# EAGLE design RaspPiPSOC (EAGLE 6.5.0)
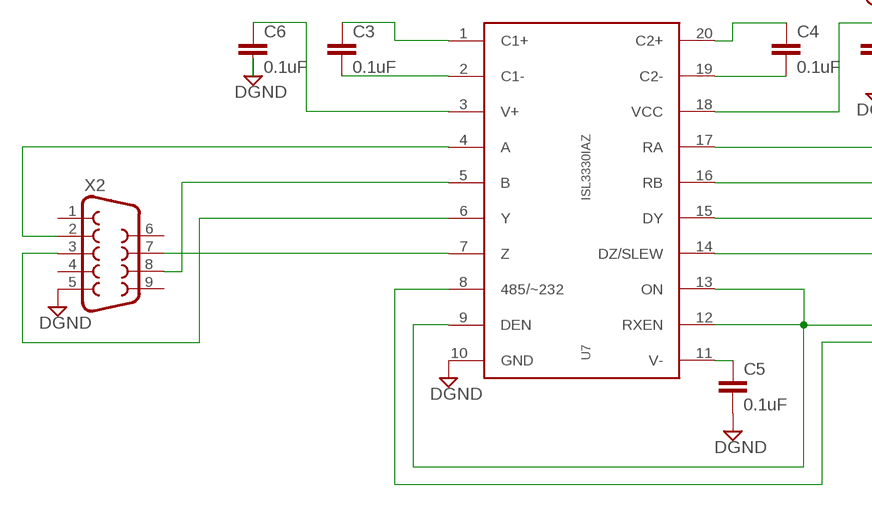
[diagram p0: schematic, sheet 1, part 1 of 2]
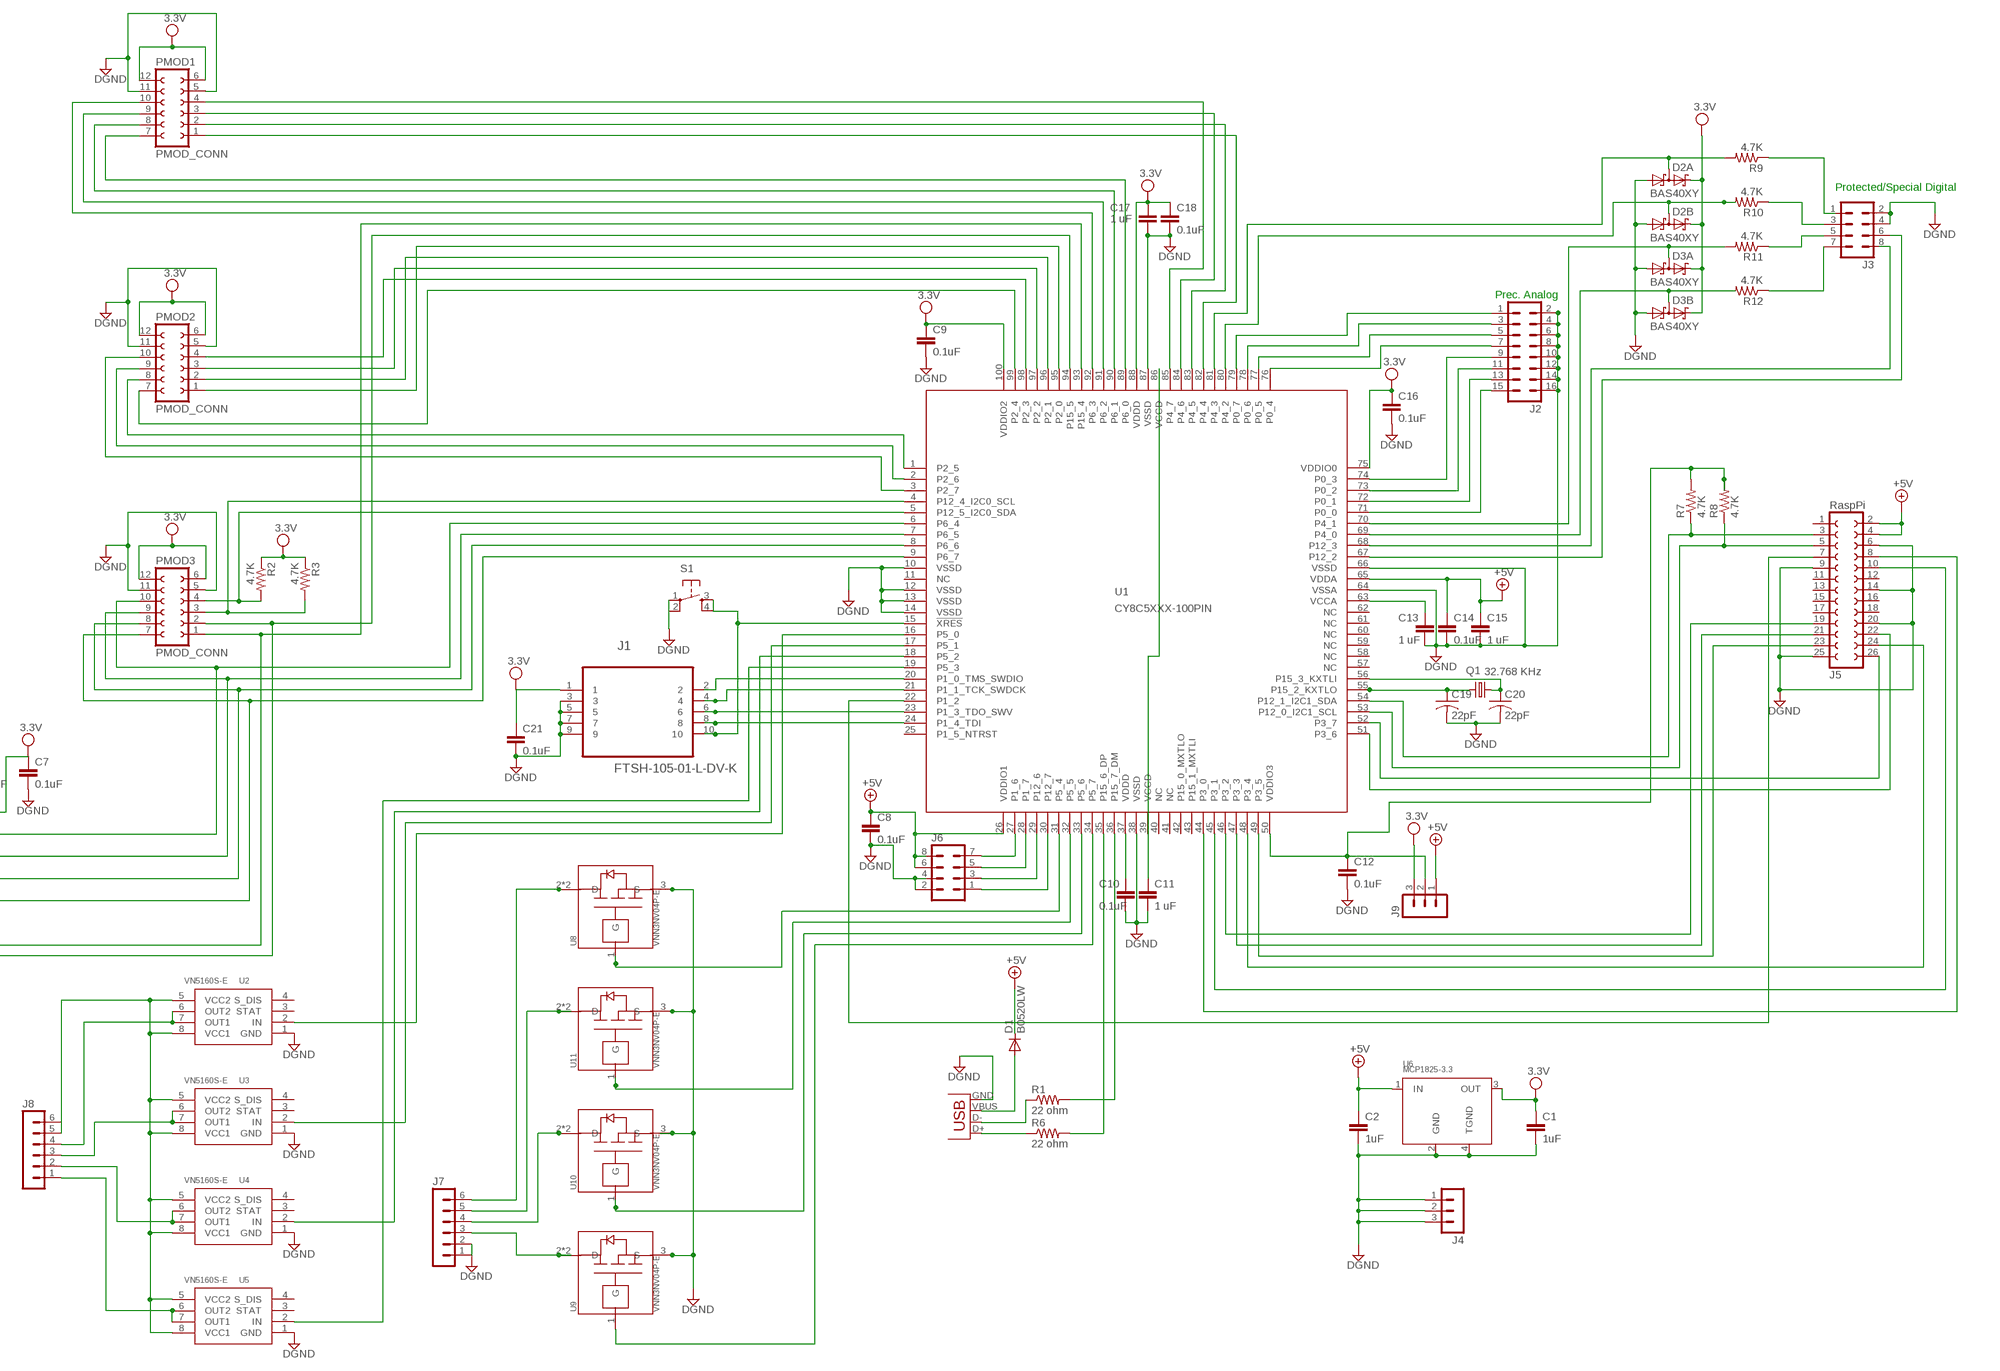
[diagram p1: schematic, sheet 1, part 2 of 2]

## Parts
C1  1uF  C-EUC0805  [C0805]
C2  1uF  C-EUC0805  [C0805]
C3  0.1uF  C-EUC0805  [C0805]
C4  0.1uF  C-EUC0805  [C0805]
C5  0.1uF  C-EUC0805  [C0805]
C6  0.1uF  C-EUC0805  [C0805]
C7  0.1uF  C-EUC0805  [C0805]
C8  0.1uF  C-EUC0805  [C0805]
C9  0.1uF  C-EUC0805  [C0805]
C10  0.1uF  C-EUC0805  [C0805]
C11  1 uF  C-EUC0805  [C0805]
C12  0.1uF  C-EUC0805  [C0805]
C13  1 uF  C-EUC0805  [C0805]
C14  0.1uF  C-EUC0805  [C0805]
C15  1 uF  C-EUC0805  [C0805]
C16  0.1uF  C-EUC0805  [C0805]
C17  1 uF  C-EUC0805  [C0805]
C18  0.1uF  C-EUC0805  [C0805]
C19  22pF  C-USC0805  [C0805]
C20  22pF  C-USC0805  [C0805]
C21  0.1uF  C-EUC0805  [C0805]
D1  B0520LW  CGRM4003-G  [SOD-123_MINI-SMA]
D2  BAS40XY  BAS70XY  [SOT363_PHILIPS]
D3  BAS40XY  BAS70XY  [SOT363_PHILIPS]
J1  FTSH-105-01-L-DV-K  [SAMTEC_FTSH-105-01-L-DV-K]
J2  MA08-2  [MA08-2]
J3  MA04-2  [MA04-2]
J4  MA03-1  [MA03-1]
J5  RaspPi  FE13-2  [FE13-2]
J6  MA04-2  [MA04-2]
J7  MA06-1  [MA06-1]
J8  MA06-1  [MA06-1]
J9  MA03-1  [MA03-1]
PMOD1  PMOD_CONN  [PMOD_CONN]
PMOD2  PMOD_CONN  [PMOD_CONN]
PMOD3  PMOD_CONN  [PMOD_CONN]
Q1  32.768 KHz  CRYSTALTC26H  [TC26H]
R1  22 ohm  R-US_R0805  [R0805]
R2  4.7K  R-US_R0805  [R0805]
R3  4.7K  R-US_R0805  [R0805]
R6  22 ohm  R-US_R0805  [R0805]
R7  4.7K  R-US_R0805  [R0805]
R8  4.7K  R-US_R0805  [R0805]
R9  4.7K  R-US_R0805  [R0805]
R10  4.7K  R-US_R0805  [R0805]
R11  4.7K  R-US_R0805  [R0805]
R12  4.7K  R-US_R0805  [R0805]
S1  TAC_SWITCHSMD  [TACTILE_SWITCH_SMD]
U1  CY8C5XXX-100PIN  [TQFP-14X14-100]
U2  VN5160S-E  [SOIC8]
U3  VN5160S-E  [SOIC8]
U4  VN5160S-E  [SOIC8]
U5  VN5160S-E  [SOIC8]
U6  MCP1825-3.3  TC1262  [SOT223]
U7  ISL3330IAZ  [SSOP20]
U8  VNN3NV04P-E  [SOT223]
U9  VNN3NV04P-E  [SOT223]
U10  VNN3NV04P-E  [SOT223]
U11  VNN3NV04P-E  [SOT223]
X1  USBSMD  [USB-MINIB]
X2  DB9  [DB9]

## Nets
+5V: C2.1 C8.1 C14.1 C15.1 D1.C J5.2 J5.4 J6.6 J6.8 J9.1 U1.26(VDDIO1) U1.65(VDDA) U6.1(IN)
DGND: C1.2 C2.2 C5.2 C6.2 C7.2 C8.2 C9.2 C10.2 C11.2 C12.2 C13.2 C14.2 C15.2 C16.2 C17.2 C18.2 C19.2 C20.2 C21.2 D2.1(A:A1) D2.4(B:A1) D3.1(A:A1) D3.4(B:A1) J1.3 J1.5 J1.7 J1.9 J2.2 J2.4 J2.6 J2.8 J2.10 J2.12 J2.14 J2.16 J3.2 J3.4 J4.1 J4.2 J4.3 J5.6 J5.9 J5.14 J5.20 J5.25 J6.2 J6.4 J7.1 J7.2 PMOD1.5 PMOD1.11 PMOD2.5 PMOD2.11 PMOD3.5 PMOD3.11 S1.1 S1.2 U1.10(VSSD) U1.12(VSSD) U1.13(VSSD) U1.14(VSSD) U1.38(VSSD) U1.64(VSSA) U1.66(VSSD) U1.87(VSSD) U2.1(GND) U3.1(GND) U4.1(GND) U5.1(GND) U6.2(GND) U6.4(TGND) U7.10(GND) U8.3(S) U9.3(S) U10.3(S) U11.3(S) X1.GND X2.5
N$1: C12.1 J9.2 R7.2 R8.2 U1.50(VDDIO3)
N$2: PMOD3.10 U1.6(P6_4) U7.17(RA)
N$3: J8.3 U3.6(OUT2) U3.7(OUT1)
N$4: J8.2 U4.6(OUT2) U4.7(OUT1)
N$5: J8.1 U5.6(OUT2) U5.7(OUT1)
N$6: PMOD3.4 R2.2 U1.5(P12_5_I2C0_SDA)
N$7: PMOD3.3 R3.2 U1.4(P12_4_I2C0_SCL)
N$8: C20.1 Q1.1 U1.56(P15_3_KXTLI)
N$9: C19.1 Q1.2 U1.55(P15_2_KXTLO)
N$10: J5.7 U1.22(P1_2)
N$11: PMOD3.2 U1.94(P15_5) U7.8(485/~232)
N$12: PMOD3.8 U1.8(P6_6) U7.15(DY)
N$13: PMOD2.1 U1.95(P2_0)
N$14: PMOD2.2 U1.96(P2_1)
N$15: PMOD2.3 U1.97(P2_2)
N$16: PMOD2.4 U1.98(P2_3)
N$17: PMOD2.7 U1.99(P2_4)
N$18: PMOD2.8 U1.1(P2_5)
N$19: C11.1 U1.39(VCCD) U1.86(VCCD)
N$20: PMOD2.9 U1.2(P2_6)
N$21: PMOD2.10 U1.3(P2_7)
N$22: PMOD1.3 U1.84(P4_6)
N$23: PMOD1.10 U1.92(P6_3)
N$24: C10.1 U1.37(VDDD)
N$25: C13.1 U1.63(VCCA)
N$26: PMOD1.9 U1.91(P6_2)
N$27: PMOD1.8 U1.90(P6_1)
N$28: PMOD1.7 U1.89(P6_0)
N$29: J5.19 U1.46(P3_2)
N$30: PMOD1.1 U1.82(P4_4)
N$31: PMOD1.2 U1.83(P4_5)
N$32: PMOD1.4 U1.85(P4_7)
N$33: J5.22 U1.51(P3_6)
N$34: J5.26 U1.52(P3_7)
N$35: C4.1 U7.20(C2+)
N$36: C4.2 U7.19(C2-)
N$37: C3.2 U7.2(C1-)
N$38: C6.1 U7.3(V+)
N$39: C3.1 U7.1(C1+)
N$40: C5.1 U7.11(V-)
N$41: U7.4(A) X2.2
N$42: U7.6(Y) X2.3
N$43: U7.5(B) X2.8
N$44: U7.7(Z) X2.7
N$45: PMOD3.9 U1.7(P6_5) U7.16(RB)
N$47: R6.1 X1.D+
N$48: R1.1 X1.D-
N$49: R6.2 U1.35(P15_6_DP)
N$50: R1.2 U1.36(P15_7_DM)
N$51: J5.21 U1.47(P3_3)
N$52: J5.23 U1.49(P3_5)
N$53: J5.24 U1.48(P3_4)
N$54: J5.8 U1.44(P3_0)
N$55: J5.10 U1.45(P3_1)
N$56: PMOD3.1 U1.93(P15_4) U7.9(DEN) U7.12(RXEN) U7.13(ON)
N$57: PMOD3.7 U1.9(P6_7) U7.14(DZ/SLEW)
N$58: D1.A X1.VBUS
N$59: J1.10 S1.3 S1.4 U1.15(!XRES!)
N$60: J5.3 R7.1 U1.54(P12_1_I2C1_SDA)
N$61: J1.2 U1.20(P1_0_TMS_SWDIO)
N$62: J1.4 U1.21(P1_1_TCK_SWDCK)
N$63: J1.8 U1.24(P1_4_TDI)
N$65: J1.6 U1.23(P1_3_TDO_SWV)
N$66: J5.5 R8.1 U1.53(P12_0_I2C1_SCL)
N$70: J2.1 U1.79(P0_7)
N$71: J2.3 U1.78(P0_6)
N$72: J2.5 U1.77(P0_5)
N$73: J2.7 U1.76(P0_4)
N$74: J2.9 U1.74(P0_3)
N$75: J2.11 U1.73(P0_2)
N$76: J2.13 U1.72(P0_1)
N$77: J2.15 U1.71(P0_0)
N$78: D2.6(A:C1A2) R9.2 U1.81(P4_3)
N$79: D2.3(B:C1A2) R10.2 U1.80(P4_2)
N$80: D3.6(A:C1A2) R11.2 U1.70(P4_1)
N$81: D3.3(B:C1A2) R12.2 U1.69(P4_0)
N$82: J3.1 R9.1
N$83: J3.7 R12.1
N$84: J3.5 R11.1
N$85: J3.3 R10.1
N$87: U1.19(P5_3) U5.2(IN)
N$88: U1.18(P5_2) U4.2(IN)
N$89: J6.7 U1.27(P1_6)
N$90: J6.5 U1.28(P1_7)
N$91: J3.8 U1.68(P12_3)
N$92: J3.6 U1.67(P12_2)
N$93: J6.3 U1.29(P12_6)
N$94: J6.1 U1.30(P12_7)
N$95: U1.17(P5_1) U3.2(IN)
N$96: U1.34(P5_7) U9.1(G)
N$98: U1.33(P5_6) U10.1(G)
N$99: U1.32(P5_5) U11.1(G)
N$100: U1.31(P5_4) U8.1(G)
N$101: U1.16(P5_0) U2.2(IN)
N$102: J7.6 U8.2(D) U8.4(D)
N$103: J7.5 U11.2(D) U11.4(D)
N$104: J7.4 U10.2(D) U10.4(D)
N$106: J8.4 U2.6(OUT2) U2.7(OUT1)
N$107: J8.5 J8.6 U2.5(VCC2) U2.8(VCC1) U3.5(VCC2) U3.8(VCC1) U4.5(VCC2) U4.8(VCC1) U5.5(VCC2) U5.8(VCC1)
N$113: J7.3 U9.2(D) U9.4(D)
VCC: C1.1 C7.1 C9.1 C16.1 C17.1 C18.1 C21.1 D2.2(A:C2) D2.5(B:C2) D3.2(A:C2) D3.5(B:C2) J1.1 J9.3 PMOD1.6 PMOD1.12 PMOD2.6 PMOD2.12 PMOD3.6 PMOD3.12 R2.1 R3.1 U1.75(VDDIO0) U1.88(VDDD) U1.100(VDDIO2) U6.3(OUT) U7.18(VCC) ; supply symbol labelled 3.3V
Unconnected: J5.1 J5.11 J5.12 J5.13 J5.15 J5.16 J5.17 J5.18 U1.11(NC) U1.25(P1_5_NTRST) U1.40(NC) U1.41(NC) U1.42(P15_0_MXTLO) U1.43(P15_1_MXTLI) U1.57(NC) U1.58(NC) U1.59(NC) U1.60(NC) U1.61(NC) U1.62(NC) U2.3(STAT) U2.4(S_DIS) U3.3(STAT) U3.4(S_DIS) U4.3(STAT) U4.4(S_DIS) U5.3(STAT) U5.4(S_DIS) X2.1 X2.4 X2.6 X2.9

## Notes on the sheet
- Protected/Special Digital
- Prec. Analog

## Library data of the parts
C1 C2 = resistor:C-EU: CAPACITOR, European symbol
C3-C18 C21 = rcl:C-EU: CAPACITOR, European symbol
C19 C20 = resistor:C-US: CAPACITOR, American symbol
D1 = diode:CGRM400*-G: Molded plasitc,JEDEC SOD-123/Mini SMA Source: Comchip CGRM4001-G.pdf
D2 D3 = diode:BAS70XY: Silicon Schottky Diodes General-purpose diode for high-speed switching Source: BAS70_1PS7XSB70_SER_8.pdf
J1 = SAMTEC-HTSW-FTxx_By_element14_Batch_1:FTSH-105-01-L-DV-K: CONN HEADER, 1.27MM, 2X5WAY, SMT; MPN: FTSH-105-01-L-DV-K; OC_FARNELL: -; OC_NEWARK: 02M8557; PACKAGE: HEADER, 1.27MM, 2X5WAY, SMT; SUPPLIER: SAMTEC
J2 = con-lstb:MA08-2: PIN HEADER; OC_FARNELL: unknown; OC_NEWARK: unknown
J3 J6 = con-lstb:MA04-2: PIN HEADER; OC_FARNELL: unknown; OC_NEWARK: unknown
J4 J9 = con-lstb:MA03-1: PIN HEADER; OC_FARNELL: unknown; OC_NEWARK: unknown
J5 = con-lsta:FE13-2: FEMALE HEADER; OC_FARNELL: unknown; OC_NEWARK: unknown
J7 J8 = con-lstb:MA06-1: PIN HEADER; OC_FARNELL: unknown; OC_NEWARK: unknown
PMOD1-PMOD3 = CustomParts:PMOD_CONN: Diligent PMOD connector
Q1 = crystal:CRYSTAL: CRYSTAL; OC_FARNELL: unknown; OC_NEWARK: unknown
R1-R3 R6-R12 = rcl:R-US_: RESISTOR, American symbol
S1 = SparkFun:TAC_SWITCH: Momentary Switch Button commonly used for reset or general input. Spark Fun Electronics SKU : COM-00097
U1 = cypress_psoc_V1_0:CY8C5XXX-100PIN: Cypress PSoC® 5 - Programmable System on Chip, ARM Cortex-M3 Based Source Data: http://www.cypress.com/?mpn=CY8C5588AXI-060 LBR Source: http://www.westmarkelectronics.com Thomas W. Moxon Director of Engineering www.westmarkelectronics.com; MPN: CY8C5588AXI-060
U2-U5 = CustomParts:VN5160S-E
U6 = CustomParts:TC1262: "2.8V LDO Regulator"
U7 = CustomParts:ISL3330IAZ: Intersil RS-232/RS-485 transceiver
U8-U11 = CustomParts:VNN3NV04P-E
X1 = SparkFun:USB: USB Connectors USB-B-PTH is fully proven SKU : PRT-00139 USB-miniB is fully proven SKU : PRT-00587 USB-A-PCB is untested. USB-A-H is throughly reviewed, but untested. Spark Fun Electronics SKU : PRT-00437 USB-B-SMT is throughly reviewed, but untested. Needs silkscreen touching up. USB-A-S has not been used/tested USB-MB-H has not been used/tested
X2 = SparkFun:DB9: DB9 Connector Standard DB9 (D-Sub 9) serial connector. Can be used for CAN bus as well as RS485 and RS232. Footprint production proven. Spark Fun Electronics SKU : PRT-00429

## Board
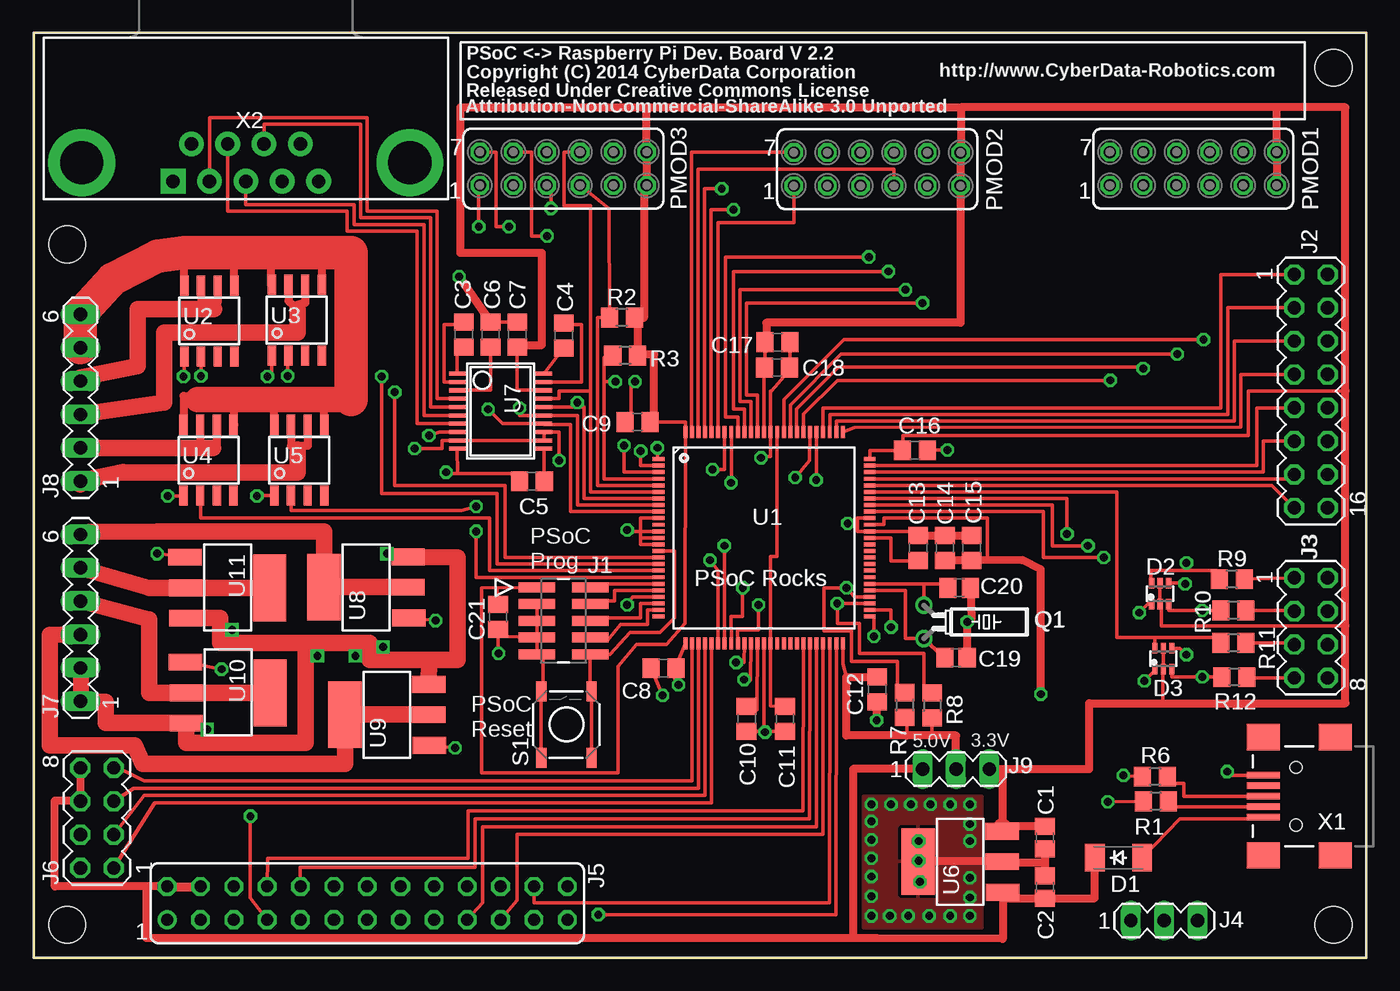
[diagram p2: board, top side]
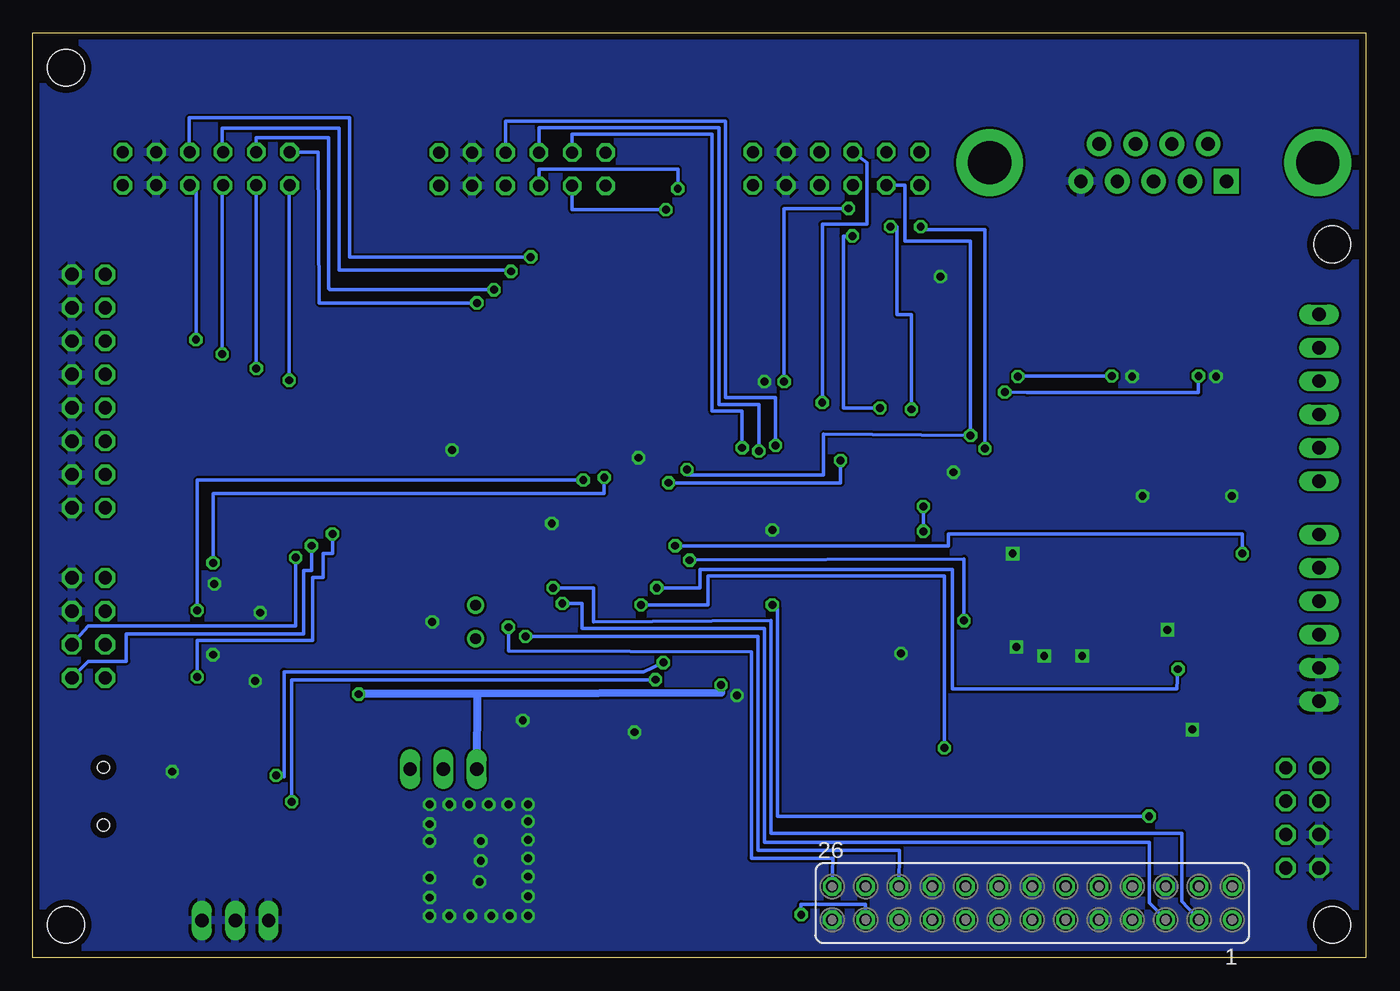
[diagram p3: board, bottom side, seen from below]

Size 101.52 x 70.47 mm. Coordinates in mm from the lower left corner, seen from the top.
Outline: 0,0 101.52,0 101.52,70.47 0,70.47 0,0
Copper layers (1*16): Top 0.035mm / dielectric 1.5mm / Bottom 0.035mm
Design rules "default *": minimum track width 10mil, minimum drill 20mil, track to track 7mil, track to pad 7mil, pad to pad 7mil, via to via 7mil, smd to smd 7mil, copper to edge 20mil, drill to drill 8mil, minimum pad ring 10mil, minimum via ring 8mil, stop-mask expansion 4mil, vias tented up to drill 0mil, thermal gap 10mil
Holes 2.8 mm at 2.54,54.36 99,67.82 2.54,2.54 99,2.54

### Footprints (pad centres in the part's own frame; a part is rotated, then mirrored left to right if it is on the bottom)
C0805 = smd 1.3 x 1.5: 1 -0.85,0; 2 0.85,0
C0805' = smd 1.3 x 1.5: 1 -0.95,0; 2 0.95,0
SOD-123_MINI-SMA = smd 1.5 x 2.1: A 1.8,0; C -1.8,0
SOT363_PHILIPS = smd 0.4 x 0.8: 1 -0.65,-0.8; 2 0,-0.8; 3 0.65,-0.8; 4 0.65,0.8; 5 0,0.8; 6 -0.65,0.8
SAMTEC_FTSH-105-01-L-DV-K = smd 0.762 x 2.794: 1 -2.54,-2.032; 2 -2.54,2.032; 3 -1.27,-2.032; 4 -1.27,2.032; 5 0,-2.032; 6 0,2.032; 7 1.27,-2.032; 8 1.27,2.032; 9 2.54,-2.032; 10 2.54,2.032
MA08-2 = drill 1.016 octagon: 1 -8.89,-1.27; 2 -8.89,1.27; 3 -6.35,-1.27; 4 -6.35,1.27; 5 -3.81,-1.27; 6 -3.81,1.27; 7 -1.27,-1.27; 8 -1.27,1.27; 9 1.27,-1.27; 10 1.27,1.27; 11 3.81,-1.27; 12 3.81,1.27; 13 6.35,-1.27; 14 6.35,1.27; 15 8.89,-1.27; 16 8.89,1.27
MA04-2 = drill 1.016 octagon: 1 -3.81,-1.27; 2 -3.81,1.27; 3 -1.27,-1.27; 4 -1.27,1.27; 5 1.27,-1.27; 6 1.27,1.27; 7 3.81,-1.27; 8 3.81,1.27
MA03-1 = drill 1.016 long: 1 -2.54,0; 2 0,0; 3 2.54,0
FE13-2 = drill 0.914: 1 -15.24,1.27 | drill 0.914 octagon: 2 -15.24,-1.27; 3 -12.7,1.27; 4 -12.7,-1.27; 5 -10.16,1.27; 6 -10.16,-1.27; 7 -7.62,1.27; 8 -7.62,-1.27; 9 -5.08,1.27; 10 -5.08,-1.27; 11 -2.54,1.27; 12 -2.54,-1.27; 13 0,1.27; 14 0,-1.27; 15 2.54,1.27; 16 2.54,-1.27; 17 5.08,1.27; 18 5.08,-1.27; 19 7.62,1.27; 20 7.62,-1.27; 21 10.16,1.27; 22 10.16,-1.27; 23 12.7,1.27; 24 12.7,-1.27; 25 15.24,1.27; 26 15.24,-1.27
MA06-1 = drill 1.016 long: 1 -6.35,0; 2 -3.81,0; 3 -1.27,0; 4 1.27,0; 5 3.81,0; 6 6.35,0
PMOD_CONN = drill 0.914 octagon: 1 -6.35,-1.27; 2 -3.81,-1.27; 3 -1.27,-1.27; 4 1.27,-1.27; 5 3.81,-1.27; 6 6.35,-1.27; 7 -6.35,1.27; 8 -3.81,1.27; 9 -1.27,1.27; 10 1.27,1.27; 11 3.81,1.27; 12 6.35,1.27
TC26H = drill 0.813: 1 -1.27,0; 2 1.27,0
R0805 = smd 1.3 x 1.5: 1 -0.95,0; 2 0.95,0
TACTILE_SWITCH_SMD = smd 1.524 x 0.762: 1 -2.54,1.905; 2 2.54,1.905; 3 -2.54,-1.905; 4 2.54,-1.905
TQFP-14X14-100 = smd 0.9 x 0.3: 1 -8.05,6; 2 -8.05,5.5; 3 -8.05,5; 4 -8.05,4.5; 5 -8.05,4; 6 -8.05,3.5; 7 -8.05,3; 8 -8.05,2.5; 9 -8.05,2; 10 -8.05,1.5; 11 -8.05,1; 12 -8.05,0.5; 13 -8.05,0; 14 -8.05,-0.5; 15 -8.05,-1; 16 -8.05,-1.5; 17 -8.05,-2; 18 -8.05,-2.5; 19 -8.05,-3; 20 -8.05,-3.5; 21 -8.05,-4; 22 -8.05,-4.5; 23 -8.05,-5; 24 -8.05,-5.5; 25 -8.05,-6; 51 8.05,-6; 52 8.05,-5.5; 53 8.05,-5; 54 8.05,-4.5; 55 8.05,-4; 56 8.05,-3.5; 57 8.05,-3; 58 8.05,-2.5; 59 8.05,-2; 60 8.05,-1.5; 61 8.05,-1; 62 8.05,-0.5; 63 8.05,0; 64 8.05,0.5; 65 8.05,1; 66 8.05,1.5; 67 8.05,2; 68 8.05,2.5; 69 8.05,3; 70 8.05,3.5; 71 8.05,4; 72 8.05,4.5; 73 8.05,5; 74 8.05,5.5; 75 8.05,6 | smd 0.3 x 0.9: 26 -6,-8.05; 27 -5.5,-8.05; 28 -5,-8.05; 29 -4.5,-8.05; 30 -4,-8.05; 31 -3.5,-8.05; 32 -3,-8.05; 33 -2.5,-8.05; 34 -2,-8.05; 35 -1.5,-8.05; 36 -1,-8.05; 37 -0.5,-8.05; 38 0,-8.05; 39 0.5,-8.05; 40 1,-8.05; 41 1.5,-8.05; 42 2,-8.05; 43 2.5,-8.05; 44 3,-8.05; 45 3.5,-8.05; 46 4,-8.05; 47 4.5,-8.05; 48 5,-8.05; 49 5.5,-8.05; 50 6,-8.05; 76 6,8.05; 77 5.5,8.05; 78 5,8.05; 79 4.5,8.05; 80 4,8.05; 81 3.5,8.05; 82 3,8.05; 83 2.5,8.05; 84 2,8.05; 85 1.5,8.05; 86 1,8.05; 87 0.5,8.05; 88 0,8.05; 89 -0.5,8.05; 90 -1,8.05; 91 -1.5,8.05; 92 -2,8.05; 93 -2.5,8.05; 94 -3,8.05; 95 -3.5,8.05; 96 -4,8.05; 97 -4.5,8.05; 98 -5,8.05; 99 -5.5,8.05; 100 -6,8.05
SOIC8 = smd 0.635 x 1.524: 1 -4.445,-2.695; 2 -3.175,-2.695; 3 -1.905,-2.695; 4 -0.635,-2.695; 5 -0.635,2.695; 6 -1.905,2.695; 7 -3.175,2.695; 8 -4.445,2.695
SOT223 = smd 1.27 x 2.54: 1 -3.586,-3.25; 2 -1.24,-3.2; 3 1.056,-3.2 | smd 5.08 x 2.54: 4 -1.24,3.2
SSOP20 = smd 0.305 x 1.245: 1 -2.857,-3.302; 2 -2.222,-3.302; 3 -1.587,-3.302; 4 -0.952,-3.302; 5 -0.317,-3.302; 6 0.318,-3.302; 7 0.953,-3.302; 8 1.588,-3.302; 9 2.223,-3.302; 10 2.858,-3.302; 11 2.858,3.302; 12 2.223,3.302; 13 1.588,3.302; 14 0.953,3.302; 15 0.318,3.302; 16 -0.317,3.302; 17 -0.952,3.302; 18 -1.587,3.302; 19 -2.222,3.302; 20 -2.857,3.302
USB-MINIB = smd 2.5 x 0.5: D+ 2.5,0; D- 2.5,0.8; GND 2.5,-1.6; ID 2.5,-0.8; VBUS 2.5,1.6 | smd 2.5 x 2: GND@1 -3,-4.5; GND@2 -3,4.5; GND@3 2.5,4.5; GND@4 2.5,-4.5 | hole 0.9: 0,2.2; 0,-2.2
DB9 = drill 1.016 pad 1.88 square: 1 -5.54,-1.42 | drill 1.016 pad 1.88: 2 -2.77,-1.42; 3 0,-1.42; 4 2.77,-1.42; 5 5.54,-1.42; 6 -4.15,1.42; 7 -1.38,1.42; 8 1.38,1.42; 9 4.15,1.42 | drill 3.302 pad 5.08: G1 -12.5,0; G2 12.5,0

### Placement (x,y rotation side)
C1  77.01,9.16 270 top
C2  77.01,5.4 90 top
C3  0.1uF  [C0805']  32.77,47.5 90 top
C4  0.1uF  [C0805']  40.36,47.4 90 top
C5  0.1uF  [C0805']  37.94,36.32 180 top
C6  0.1uF  [C0805']  34.8,47.5 90 top
C7  0.1uF  [C0805']  36.83,47.5 90 top
C8  0.1uF  [C0805']  47.96,22.09 180 top
C9  0.1uF  [C0805']  45.97,40.83 180 top
C10  0.1uF  [C0805']  54.29,18.21 270 top
C11  1 uF  [C0805']  57.22,18.21 270 top
C12  0.1uF  [C0805']  64.25,20.46 270 top
C13  1 uF  [C0805']  67.37,31.24 90 top
C14  0.1uF  [C0805']  69.41,31.24 90 top
C15  1 uF  [C0805']  71.44,31.24 90 top
C16  0.1uF  [C0805']  67.12,38.67 0 top
C17  1 uF  [C0805']  56.66,46.91 0 top
C18  0.1uF  [C0805']  56.61,44.98 0 top
C19  70.25,22.87 0 top
C20  70.49,28.19 0 top
C21  0.1uF  [C0805']  35.37,25.97 270 top
D1  82.62,7.63 0 top
D2  85.79,27.75 0 top
D3  86.04,22.8 0 top
J1  40.35,25.68 270 top
J2  97.28,43.18 270 top
J3  97.28,25.15 270 top
J4  86.11,2.86 0 top
J5  25.4,4.17 180 bottom
J6  4.83,10.67 90 top
J7  3.56,25.91 90 top
J8  3.56,42.67 90 top
J9  70.25,14.4 0 top
PMOD1  88.31,60.12 0 top
PMOD2  64.25,60.09 0 top
PMOD3  40.34,60.13 0 top
Q1  67.8,25.6 270 top
R1  85.47,11.93 180 top
R2  44.8,48.78 180 top
R3  45.05,45.89 180 top
R6  85.4,13.81 180 top
R7  66.34,19.26 270 top
R8  68.42,19.23 270 top
R9  91.26,28.86 180 top
R10  91.38,26.48 180 top
R11  91.38,24 180 top
R12  91.44,21.4 180 top
S1  40.56,17.78 90 top
U1  55.63,32 0 top
U2  15.91,48.52 0 top
U3  22.58,48.59 0 top
U4  15.85,37.92 0 top
U5  22.77,37.92 0 top
U6  70.55,8.59 90 top
U7  35.56,41.66 270 top
U8  25.31,29.49 90 top
U9  26.89,19.78 90 top
U10  14.81,18.95 270 top
U11  14.77,26.94 270 top
X1  96.14,12.32 180 top
X2  16.15,60.59 0 top

### Tracks (layer width: path | path; a pad name or v marks a point on that pad's centre or on a via)
+5V  (via drill 0.6)
  Top 0.254: U1.65 64.77,33 64.77,33.53 72.64,33.53 72.64,30.48 71.44,30.48 C15.1 | U1.26 48.8,22 C8.1
  Top 0.61: C14.1 C15.1 75.3,30.3 76.7,29.6 v76.7,20.1 | J6.8 J6.6 3.56,12 1.6,12 1.6,5.44 8.6,5.44 | 8.6,5.44 J5.2 12.1,5.44 10.3,5.4 12.6,5.4 J5.4 | 62.4,1.5 64.2,1.5 73.8,1.45 U6.1 73.81,4.55 C2.1 80.82,4.55 D1.C | 62.4,1.5 8.6,1.5 8.6,5.44 | J9.1 62.4,14.4 62.4,1.5 | 48.8,22 v49.1,20.8
  Bottom 0.61: v49.1,20.8 49.1,20.2 67.7,20.1 | 67.7,20.1 J9.1 | 67.7,20.1 v76.7,20.1
DGND  (via drill 0.6)
  Top 0.254: J1.3 J1.5 J1.7 | J1.7 J1.9 38.32,23 38.8,23 38.8,20.32 S1.2 S1.1 | C21.2 35.37,24.51 | 35.37,24.51 J1.7 | C6.2 C7.2 | C13.2 67.37,32.5 U1.64 62.74,32.5 62.74,33.1 | 62.74,33.1 62.74,33.53 63.68,33.53 U1.66 | C17.2 57.61,44.88 C18.2 57.4,44.58 56.2,43.2 56.1,43.2 56.1,43.1 56.13,43.1 U1.87 56.1,40.05 56.1,38.2 55.4,38.2 v55.4,38.1 | U1.10 46.2,33.5 46.2,32.5 | 46.2,32.5 U1.12 | U1.13 46.2,32 | 46.2,32 46.2,32.5 | U1.14 46.2,31.5 46.2,32 | U7.10 32.3,36.9 | 32.3,36.9 36.3,36.9 C5.2 | 55.7,17.26 C11.2 55.5,17.3 55.6,17.2 U1.38 | 55.7,17.26 C10.2 | v55.7,17.2 55.7,17.26 | C8.2 v47.9,20 | v62,33.1 62.74,33.1 | 46.2,32.5 45.2,32.5 v45.2,32.6 | v45.8,43.9 45.5,43.9 45.5,41.1 45.02,41.1 C9.2 | 32.3,36.9 31.4,36.9 v31.4,37 | v69.6,38.7 68.07,38.7 C16.2 | X1.GND 90.9,13.92 v90.9,14.2 | D3.1 85.39,21.89 v84.6,21.1 | D3.4 87.3,23.6 v87.8,23.1 | D2.1 84.85,26.95 v84.2,26.3 | D2.4 87.65,28.55 v87.7,28.5 | 35.37,24.51 35.37,23.23 v35.4,23.2 | U2.1 11.47,44.37 v11.4,44.3 | U3.1 18.14,44.64 v17.8,44.3 | U5.1 17.03,35.23 v17,35.2 | v10.2,35.2 11.38,35.2 U4.1
  Top 0.305: 71.4,25.79 v71.1,25.6 71.1,25.1
  Top 0.61: C13.2 C14.2 C15.2 | C1.2 77.01,7.3 | 77.01,7.3 C2.2 | 77.01,7.3 73.75,7.3 U6.2 73.75,7.4 73.4,7.4 73.4,7.35 U6.4 | v32.4,51.9 C6.2 | C20.2 71.4,25.79 | C19.2 71.1,25.1 | C12.2 64.2,19.51 v64.2,18.1
  Top 1.27: U8.3 32.3,30.5 32.3,22.7 30.1,22.69 | 30.1,22.69 U9.3 | U11.3 14.2,25.9 14.2,24 20.7,24 | 20.7,24 25.6,24 25.6,22.7 30.1,22.69 | J7.1 5.5,19.5 5.5,17.9 9.4,17.9 U10.3 11.6,17.6 11.6,16.4 20.7,16.4 20.7,24
  Bottom 0.254: v64.2,18.1 64.2,18.4
  other vias: 63.8,11.7 63.8,10.4 63.8,9 63.8,7.6 63.8,6.2 63.8,4.7 63.8,3.2 65.2,3.2 66.6,3.2 68.2,3.2 69.8,3.2 71.3,3.2 65.3,11.7 66.8,11.7 68.3,11.7 69.8,11.7 71.3,11.7 15.1,25 26.9,30.8 26.6,23.7 24.5,23 21.6,23 13.2,17.4 71.3,10.2 71.3,8.9 71.3,6.1 71.3,4.6 67.4,8.9 67.4,7.4 67.5,5.8
  pour Bottom: 100.8,69.7 100.8,0.7 0.8,0.7 0.8,0.8 0.7,0.8 0.7,69.8
  pour Top: 72.2,2.3 72.2,12.3 63.2,12.3 63.2,4.9 63.2,2.3
N$1
  Top 0.254: U1.50 61.63,22.41 61.9,21.41 | R7.2 66.5,18.31 66.5,16.95 | R8.2 68.4,18.28 68.4,16.95
  Top 0.61: J9.2 70.25,16.95 68.4,16.95 66.5,16.95 61.9,16.95 61.9,21.41 C12.1
N$2
  Top 0.254: 42.42,43.2 42.42,57.3 40.4,57.3 40.4,61.4 PMOD3.10 | 42.42,43.2 42.42,35.5 U1.6 | U7.17 40,42.6 40,43.2 42.42,43.2
N$3
  Top 0.61: 20.1,49.41 19.98,49.54 | 19.98,49.54 19.85,49.67 20.68,49.92 U3.6 | U3.7 19.41,50.05 19.98,49.54
  Top 1.27: J8.3 9.94,42.3 9.94,47.64 20.1,47.64 20.1,49.41
N$4
  Top 0.61: U4.7 12.68,38.75 13.55,38.85 | U4.6 13.94,38.75 13,38.85
  Top 1.27: J8.2 13.66,38.86 13.66,38.85 13.55,38.85 13,38.85
N$5
  Top 0.61: U5.7 19.6,39 20.1,38.75 20.1,39 20.87,39 U5.6
  Top 1.27: 3.56,36.07 J8.1 6.8,37 6.8,36.97 20.1,36.97 20.1,38.75
N$6
  Top 0.254: U1.5 42.93,36 42.93,48.77 43.85,48.77 R2.2 43.81,57.08 PMOD3.4
N$7  (via drill 0.6)
  Top 0.254: U1.4 43.43,36.5 43.43,43.9 | R3.2 44.1,45.72 43.43,45.72 43.43,44 43.43,43.9 | PMOD3.3 39.4,58.86 v39.4,57.1 | v44.3,43.9 43.43,43.9
  Bottom 0.254: v39.4,57.1 44.3,57.1 v44.3,43.9
N$8
  Top 0.254: U1.56 67.8,28.5 | 67.8,28.5 69.64,28.5 C20.1 | Q1.1 67.8,28.5
N$9
  Top 0.254: U1.55 66.37,28 66.37,24.33 Q1.2
  Top 0.305: Q1.2 68.3,23.86 C19.1
N$10  (via drill 0.6)
  Top 0.254: U1.22 45.6,27.5 v45.2,26.9 | v16.5,10.8 16.5,4.6 J5.7
  Bottom 0.254: v45.2,26.9 45.2,26.6 44.8,26.6 44.8,10.8 v16.5,10.8
N$11  (via drill 0.6)
  Top 0.254: U7.8 30.9,40.07 v30.1,39.8 | v51.7,37.2 52.63,37.2 U1.94
  Bottom 0.254: v51.7,37.2 51.7,36.8 41.3,36.8 41.3,39.9 v30.1,39.8 30.1,54.6 35.1,54.6 35.1,58.86 PMOD3.2
N$12  (via drill 0.6)
  Top 0.254: U1.8 41.4,34.5 41.4,41.34 U7.15 37,41.34 v37,41.9 | PMOD3.8 37.9,61.4 37.9,55 v39.1,55
  Bottom 0.254: v39.1,55 39.8,55 39.8,41.9 v37,41.9
N$13
  Top 0.254: U1.95 52.1,40.05 52.1,56 57.9,56 PMOD2.1
N$14  (via drill 0.6)
  Top 0.254: U1.96 51.6,40.05 51.6,57 v53.3,57
  Bottom 0.254: v53.3,57 60.44,57 PMOD2.2
N$15  (via drill 0.6)
  Top 0.254: U1.97 51.1,40.05 51.1,58.6 v52.4,58.6
  Bottom 0.254: v52.4,58.6 52.4,60.1 62.98,60.1 PMOD2.3
N$16
  Top 0.254: U1.98 50.6,40.05 50.6,60.1 65.52,60.1 PMOD2.4
N$17
  Top 0.254: U1.99 50.1,40.05 50.1,61.4 57.9,61.4 PMOD2.7
N$18  (via drill 0.6)
  Top 0.254: U1.1 47.5,38 v47.5,38.86
  Bottom 0.254: v47.5,38.86 47.5,41.66 49.78,41.66 49.78,62.74 60.44,62.74 PMOD2.8
N$19
  Top 0.254: U1.86 56.6,40.05 56.6,30.6 56.13,30.6 U1.39 56.1,19.2 C11.1
N$20  (via drill 0.6)
  Top 0.254: U1.2 46.23,37.5 v46.23,38.61
  Bottom 0.254: v46.23,38.61 46.23,42.16 49.28,42.16 49.28,63.25 62.98,63.25 PMOD2.9
N$21  (via drill 0.6)
  Top 0.254: U1.3 44.96,37 v44.96,39.05
  Bottom 0.254: v44.96,39.05 44.96,42.67 48.77,42.67 48.77,63.75 65.52,63.75 PMOD2.10
N$22  (via drill 0.6)
  Top 0.254: U1.84 57.63,42.13 61.5,46 v87.1,46
  Bottom 0.254: v87.1,46 87.1,58.8 PMOD1.3
N$23  (via drill 0.6)
  Top 0.254: v63.6,53.4 52.7,53.4 52.7,41.2 53.63,41.2 U1.92
  Bottom 0.254: PMOD1.10 89.6,61.4 89.6,64 77.4,64 77.4,53.4 v63.6,53.4
N$24
  Top 0.254: U1.37 55.1,18.9 C10.1
N$25
  Top 0.254: U1.63 65.28,32 65.28,30.23 67.37,30.23 C13.1
N$26  (via drill 0.6)
  Top 0.254: v65.1,52.3 53.3,52.3 53.3,41.8 54.13,41.8 U1.91
  Bottom 0.254: PMOD1.9 87.1,61.4 87.1,63.2 78.2,63.2 78.2,52.4 65.1,52.4 v65.1,52.3
N$27  (via drill 0.6)
  Top 0.254: v66.4,50.9 53.8,50.9 53.8,42.4 54.63,42.4 U1.90
  Bottom 0.254: PMOD1.8 84.5,62.5 79,62.5 79,51 78.9,51 78.9,50.9 v66.4,50.9
N$28  (via drill 0.6)
  Top 0.254: v67.7,49.9 54.3,49.9 54.3,42.9 55.13,42.9 U1.89
  Bottom 0.254: PMOD1.7 82.06,61.4 79.8,61.4 79.7,49.9 v67.7,49.9
N$29
  Top 0.254: U1.46 59.6,10 34.2,10 34.2,4.2 J5.19
N$30  (via drill 0.6)
  Top 0.254: U1.82 58.63,41.43 61.2,44 v82,44
  Bottom 0.254: v82,44 82,58.82 PMOD1.1
N$31  (via drill 0.6)
  Top 0.254: U1.83 58.1,40.05 58.1,41.8 61.3,45 84.4,45 v84.5,44.9
  Bottom 0.254: v84.5,44.9 PMOD1.2
N$32  (via drill 0.6)
  Top 0.254: U1.85 57.13,42.53 61.7,47.1 v89.1,47.1
  Bottom 0.254: PMOD1.4 89.1,58.85 v89.1,47.1
N$33  (via drill 0.6)
  Top 0.254: U1.51 64,26 v64,24.5
  Bottom 0.254: v64,24.5 46.3,24.5 46.3,8.2 35.5,8.2 J5.22
N$34  (via drill 0.6)
  Top 0.254: U1.52 65.3,26.5 v65.3,25.2
  Bottom 0.254: v65.3,25.2 65.3,23.4 46.8,23.3 46.8,7.6 40.6,7.6 J5.26
N$35
  Top 0.254: U7.20 C4.1
N$36
  Top 0.254: U7.19 41.73,43.88 41.73,48.26 40.96,48.26 C4.2
N$37
  Top 0.254: U7.2 31.24,43.88 31.24,48.26 32.77,48.26 C3.2
N$38
  Top 0.254: U7.3 34.8,43.24 C6.1
N$39
  Top 0.254: C3.1 32.26,46.29 U7.1
N$40
  Top 0.254: U7.11 38.86,36.32 C5.1
N$41
  Top 0.254: U7.4 30.73,42.61 30.73,56.9 25.4,56.9 25.4,64.01 13.38,64.01 X2.2
N$42
  Top 0.254: U7.6 29.72,41.34 29.72,55.88 24.38,55.88 24.38,57.4 16.15,57.4 X2.3
N$43
  Top 0.254: U7.5 30.23,41.97 30.23,56.39 24.89,56.39 24.89,63.5 17.53,63.5 X2.8
N$44
  Top 0.254: U7.7 29.21,40.7 29.21,55.37 23.88,55.37 23.88,56.9 14.77,56.9 X2.7
N$45  (via drill 0.6)
  Top 0.254: 41.5,41.97 41.91,41.97 41.91,35 U1.7 | 41.5,41.97 U7.16 | v41.4,42.3 41.5,42.7 41.5,41.97
  Bottom 0.254: PMOD3.9 38,60.6 38,55.9 41.4,55.9 v41.4,42.3
N$47
  Top 0.254: X1.D+ 87.6,12.32 87.6,13.3 86.35,13.3 R6.1
N$48
  Top 0.254: X1.D- 86.42,11.52 R1.1
N$49  (via drill 0.6)
  Top 0.254: U1.35 54.1,22.5 v53.5,22.5 | v83,13.9 R6.2
  Bottom 0.254: v83,13.9 82.4,13.8 82.4,21.8 55,21.8 v53.5,22.5
N$50  (via drill 0.6)
  Top 0.254: U1.36 54.6,21.2 v54.1,21.2 | v81.8,11.9 R1.2
  Bottom 0.254: v54.1,21.2 81.8,21.2 v81.8,11.9
N$51
  Top 0.254: U1.47 60.1,9.4 36.8,9.4 36.8,4.4 J5.21
N$52  (via drill 0.6)
  Top 0.254: U1.49 61.1,3.9 61.1,3.3 v43,3.3
  Bottom 0.254: v43,3.3 43,4.1 38.1,4.1 J5.23
N$53
  Top 0.254: U1.48 60.6,4.2 38.1,4.2 J5.24
N$54
  Top 0.254: U1.44 58.6,11.2 33.1,11.2 33.1,7.6 17.8,7.6 J5.8
N$55
  Top 0.254: U1.45 59.1,10.6 33.6,10.6 33.6,6.9 20.3,6.9 J5.10
N$56  (via drill 0.6)
  Top 0.254: v40,37.9 40,40.07 U7.13 U7.12 U7.9 32.26,39.4 31.1,39.4 31.1,38.8 v29,38.8 | v53.1,36.2 53.13,36.2 U1.93 | PMOD3.1 33.9,58.66 v33.9,55.7
  Bottom 0.254: v40,37.9 40,36.2 v53.1,36.2 | v29,38.8 29,55.5 33.9,55.5 v33.9,55.7
N$57  (via drill 0.6)
  Top 0.254: U1.9 40.89,34 40.89,40.64 38.86,40.64 U7.14 | PMOD3.7 35.2,61.4 35.2,55.7 v36.2,55.7 | U7.14 | U7.14 35.7,40.7 v34.6,41.8
  Bottom 0.254: 36.1,55.7 v36.2,55.7 35.7,55.7 35.7,49 34.6,49 v34.6,41.8
N$58
  Top 0.254: X1.VBUS 93.64,10.6 87.3,10.6 D1.A 84.4,7.63
N$59
  Top 0.254: S1.3 S1.4 42.38,20.32 J1.10 43.89,23.11 | U1.15 48.8,31 48.8,25.9 47.7,24.8 45.4,24.8 43.89,23.11 | 42.7,23 43.89,23.11
N$60  (via drill 0.6)
  Top 0.254: U1.54 62.5,27.5 v61.9,28.2 60.2,28.2 60.2,24.9 62.3,24.9 62.3,22.6 65.8,22.6 65.8,20.21 R7.1
  Bottom 0.254: v61.9,28.2 58.8,28.2 58.8,25.6 45.3,25.7 45.3,9.5 14,9.5 14,4.3 J5.3
N$61
  Top 0.254: U1.20 43.69,28.5 43.69,28.45 42.48,28.45 J1.2
N$62
  Top 0.254: U1.21 44.25,28 44.25,27.18 42.48,27.18 J1.4
N$63
  Top 0.254: U1.24 46.74,26.5 46.74,25.4 44.7,25.4 43.7,24.2 J1.8 42.48,24.64
N$65
  Top 0.254: U1.23 46.23,27 46.23,25.91 42.48,25.91 J1.6
N$66  (via drill 0.6)
  Top 0.254: U1.53 v61.2,27 61.2,25.5 62.9,25.5 62.9,23.2 67.8,23.2 67.8,20.18 R8.1
  Bottom 0.254: v61.2,27 59.7,27 59.7,25.1 45.8,25.1 45.8,8.8 16.5,8.8 16.5,4.2 J5.5
N$70
  Top 0.254: U1.79 60.13,41.91 90.42,41.91 90.42,52.07 J2.1
N$71
  Top 0.254: U1.78 60.63,41.4 90.93,41.4 90.93,49.53 J2.3
N$72
  Top 0.254: U1.77 61.13,40.89 91.44,40.89 91.44,46.99 J2.5
N$73
  Top 0.254: J2.7 91.92,44.45 91.92,40.45 62.5,40.4 U1.76
N$74
  Top 0.254: U1.74 93.16,37.5 93.16,41.91 J2.9
N$75
  Top 0.254: U1.73 93.65,37 93.65,39.37 J2.11
N$76
  Top 0.254: U1.72 95.69,36.5 J2.13
N$77
  Top 0.254: U1.71 94.3,36 J2.15
N$78  (via drill 0.6)
  Top 0.254: D2.6 85.1,28.55 85.1,29.5 87.8,29.5 | 87.8,29.5 90.11,29.5 R9.2 | U1.81 59.1,37.9 v58,36.6 | v87.8,30.1 87.8,29.5
  Bottom 0.254: v58,36.6 58,35.4 87.8,35.4 v87.8,30.1
N$79  (via drill 0.6)
  Top 0.254: R10.2 v89,26.48 88.8,26.48 86.44,26.48 D2.3 | U1.80 v59.6,36.4
  Bottom 0.254: v59.6,36.4 89,36.4 v89,26.48
N$80
  Top 0.254: D3.6 85.4,24.4 | 85.4,24.4 90.43,24.4 R11.2 | U1.70 82.5,35.5 82.5,24.4 85.4,24.4
N$81  (via drill 0.6)
  Top 0.254: R12.2 v89,21.4 86.69,21.4 D3.3 | U1.69 78.7,35 v78.7,32.3
  Bottom 0.254: v78.7,32.3 78.7,30.8 79.4,30.8 79.4,29 80.2,29 80.2,24.2 89,24.2 v89,21.4
N$82
  Top 0.254: R9.1 J3.1
N$83
  Top 0.254: R12.1 92.46,21.4 92.46,21.34 J3.7
N$84
  Top 0.254: R11.1 96.01,24 J3.5
N$85
  Top 0.254: R10.1 96.01,26.48 J3.3
N$87  (via drill 0.6)
  Top 0.254: U1.19 33.7,29 v33.7,32.5 | v33.7,34.4 32.6,34.1 19.6,34.1 U5.2
  Bottom 0.254: v33.7,32.5 v33.7,34.4
N$88
  Top 0.254: U1.18 34.7,29.5 34.7,33.5 12.7,33.5 12.7,35.23 U4.2
N$89
  Top 0.254: J6.7 6.42,14.48 8.4,13.5 50.13,13.5 U1.27
N$90
  Top 0.254: U1.28 50.63,12.94 7.6,12.94 J6.5
N$91  (via drill 0.6)
  Top 0.254: U1.68 77.6,34.5 77.6,31.4 v80.3,31.4
  Bottom 0.254: J3.8 97.3,22.6 94.4,22.6 94.4,24.7 80.9,24.7 80.9,29.5 80.3,29.5 v80.3,31.4
N$92  (via drill 0.6)
  Top 0.254: U1.67 76.9,34 76.9,30.5 v81.5,30.5
  Bottom 0.254: v81.5,30.5 81.5,25.3 97.3,25.3 J3.6
N$93
  Top 0.254: J6.3 8.4,12.4 51.13,12.4 U1.29
N$94
  Top 0.254: J6.1 9.2,11.8 51.63,11.8 U1.30
N$95  (via drill 0.6)
  Top 0.254: U3.2 19.34,45.89 v19.34,44.33 | U1.17 35.3,30 35.3,35.4 26.5,35.4 v26.5,44.3
  Bottom 0.254: v19.34,44.33 26.5,44.33 v26.5,44.3
N$96  (via drill 0.6)
  Top 0.254: U1.34 53.6,25 55.2,25 v55.2,26.9 | v32.1,16 U9.1
  Bottom 0.254: v55.2,26.9 50.1,26.9 50.1,29.1 32.1,29.1 v32.1,16
N$98  (via drill 0.6)
  Top 0.254: U1.33 53.1,26 54,26 v54,28.2 | v14.3,22 U10.1
  Bottom 0.254: v54,28.2 50.7,28.2 50.7,29.6 31.5,29.6 31.5,20.5 14.4,20.5 v14.3,22
N$99  (via drill 0.6)
  Top 0.254: U11.1 v9.4,30.8 | v52.6,31.4 52.6,29.6 U1.32
  Bottom 0.254: v9.4,30.8 9.4,32.3 31.8,32.3 31.8,31.4 v52.6,31.4
N$100  (via drill 0.6)
  Top 0.254: U1.31 52.1,29.5 v51.5,30.3 | v30.6,25.7 U8.1
  Bottom 0.254: v51.5,30.3 30.6,30.4 v30.6,25.7
N$101  (via drill 0.6)
  Top 0.254: U2.2 v12.74,44.33 | v27.5,43.1 27.5,36 35.9,36 35.9,30.5 37,30.5 37.4,30.5 U1.16
  Bottom 0.254: v12.74,44.33 12.74,43.06 25.81,43.06 v27.51,43.1 v27.5,43.1
N$102
  Top 1.27: J7.6 4.24,32.46 9.4,32.5 22.11,32.5 U8.4 U8.2
N$103
  Top 1.27: U11.4 U11.2 8.8,28.2 J7.5
N$104
  Top 1.27: U10.4 12.1,20.19 | 12.1,20.19 U10.2 | J7.4 8.8,25.8 8.8,20.2 12.1,20.19
N$106
  Top 0.61: U2.7 12.74,49.92 | 12.74,49.92 12.74,49.41 | 14.01,51.45 U2.6 14.01,49.92 12.74,49.92
  Top 1.27: J8.4 3.56,44.2 7.91,45.1 7.91,49.41 12.74,49.41 13.75,49.41
N$107
  Top 0.406: 21.88,53.73 21.95,53.48
  Top 0.61: 21.95,53.48 U3.5 | U3.8 18.07,51.28 18.07,53.73 | U2.5 15.28,53.73 | U2.8 11.47,53.73 | U5.5 22.14,42.56 | 12.48,42.56 11.4,42.81 U4.8 | U4.5 15.28,40.62 15.28,42.56 | U5.8 18.33,42.56
  Top 1.93: 12.48,42.56 15.28,42.56 18.33,42.56 22.14,42.56 24.17,42.56
  Top 2.54: J8.5 J8.6 6.03,51.72 9.44,53.48 11.47,53.73 15.28,53.73 18.07,53.73 21.88,53.73 24.17,53.73 24.17,42.56
N$113
  Top 1.27: U9.2 U9.4 23.7,14.8 8.3,14.8 7.7,16.2 1.2,16.2 1.2,24.6 J7.3
VCC
  Top 0.254: U7.18 36.83,43.24 | 36.83,43.24 C7.1 | C16.1 63.68,38.67 | 63.68,38.67 U1.75 | C9.1 49.63,40.83 U1.100 49.6,25.5 48.2,23.9 45.9,23.9 44.5,22.2 44.5,14.1 34.1,14.1 34.1,28.2 J1.1 35.3,28.2 C21.1 | C17.1 55.71,45.08 C18.1 55.63,44.58 U1.88 | 86,19.4 86,22 D3.2 D3.5 | D2.5 D2.2 85.9,26.95 85.9,25.3 99.9,25.3 | 63.68,38.67 66.2,38.7 66.2,39.8 92.5,39.8 92.5,43.2 99.9,43.2 | 36.83,43.24 36.8,46.7
  Top 0.61: C9.1 47.24,40.83 47.24,45.97 46,45.97 R3.1 46,48.78 R2.1 45.75,48.77 46.48,48.77 46.48,58.86 PMOD3.6 PMOD3.12 46.69,64.8 | PMOD1.6 PMOD1.12 94.66,64.8 | 94.66,64.8 70.6,64.8 | 70.6,64.8 PMOD2.12 PMOD2.6 70.6,48.4 55.8,48.4 55.8,46.41 C17.1 | 46.69,64.8 70.6,64.8 | C1.1 73.75,10.02 U6.3 | J9.3 73.8,14.4 | 73.8,14.4 80.4,14.4 80.4,19.4 86,19.4 99.9,19.4 99.9,25.3 99.9,43.2 99.9,64.8 94.66,64.8 | 73.8,10 73.8,14.4 | 36.8,46.7 38.7,46.7 38.7,53.7 32.5,53.7 32.5,64.8 46.69,64.8
  Top 1.27: 73.75,10.02 73.8,10
(copper drawn outside any net)
  shapes: Top area x1

### Text on the board
_tsilk: PSoC <-> Raspberry Pi Dev. Board V 2.2 | Copyright (C) 2014 CyberData Corporation | http://www.CyberData-Robotics.com | Released Under Creative Commons License | Attribution-NonCommercial-ShareAlike 3.0 Unported | X2 | 7 | 7 | 7 | 1 | 1 | 1 | PMOD3 | PMOD2 | PMOD1 | J2 | 1 | R2 | C3 | C6 | C7 | C4 | 6 | U2 | U3 | R3 | C17 | U7 | C18 | C9 | C16 | U4 | U5 | 1 | C15 | 16 | J8 | C5 | U1 | C13 | C14 | 6 | J3 | U11 | R9 | PSoC / Prog | J1 | D2 | 1 | PSoC Rocks | C20 | R10 | C21 | U8 | Q1 | R11 | U10 | C12 | C19 | C8 | 8 | R8 | D3 | R12 | 1 | J7 | R7 | PSoC / Reset | U9 | C10 | C11 | 5.0V | 3.3V | S1 | R6 | 8 | 1 | J9 | C1 | R1 | X1 | J5 | J6 | 1 | U6 | D1 | 1 | 1 | J4 | C2
_bsilk: PSoC <-> Raspberry Pi Dev. Board V 2.2 | http://www.CyberData-Robotics.com | Copyright (C) 2014 CyberData Corporation | Released Under Creative Commons License | Attribution-NonCommercial-ShareAlike 3.0 Unported